# Altium schematic sheet Top.schdoc
size 297 x 209 mm; Symbol: Drawing-Symbol_A4; Company: 嘉立创EDA; Version: V1.0; Page Size: A4; @Project Name: Buck电路; @Update Date: 2026-08-22; @Create Date: 2026-08-22; Device: Drawing-Symbol_A4; @Board Name: Board1; @Page Name: P1; @Create Time: 15:29:09; @Page Count: 1; @Page No: 1; @Schematic Name: Schematic1; @Update Time: 15:29:09; @Assembly Variant: Basic; Border: 1; Title Block Position: 3; Size: A4; Width: 1170; Height: 825; Region Start: 1; X Region Count: 6; Y Region Count: 4; Blade Width: 10
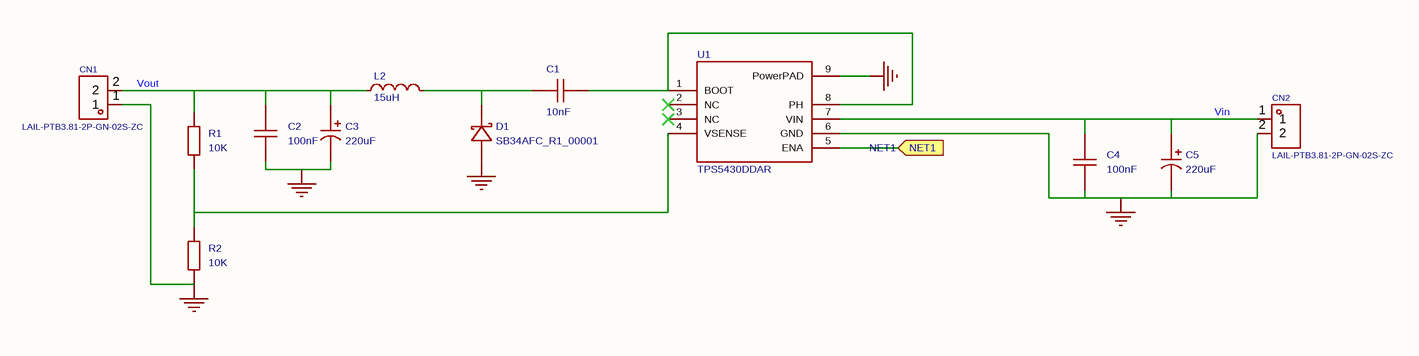
[diagram p0: Top.schdoc]

## Parts
C1  10nF  [C0603]
C2  100nF  [C0603]
C3  220uF  [CAP-SMD_BD6.3-L6.6-W6.6-LS7.3-FD]
C4  100nF  [C0603]
C5  220uF  [CAP-SMD_BD6.3-L6.6-W6.6-LS7.3-FD]
CN1  LAIL-PTB3.81-2P-GN-02S-ZC  [CONN-TH_LAIL-PTB3.81-2P-GN-02S-ZC]
CN2  LAIL-PTB3.81-2P-GN-02S-ZC  [CONN-TH_LAIL-PTB3.81-2P-GN-02S-ZC]
D1  SB34AFC_R1_00001  [SMAF_L3.5-W2.6-LS4.7-RD]
L2  15uH  [IND-SMD_L7.0-W6.6_FXL0630]
R1  10K  [R0603]
R2  10K  [R0603]
U1  TPS5430DDAR  [ESOP-8_L4.9-W3.9-P1.27-LS6.0-TL-EP]

## Ports
NET1 (in)

## Nets
GND: C2.1 C3.2 C4.1 C5.2 CN1.1 CN2.2 D1.2(A) R2.1 U1.6(GND) U1.9(PowerPAD)
NET1: U1.5(ENA) ; port NET1
Vin: C4.2 C5.1 CN2.1 U1.7(VIN)
Vout: C2.2 C3.1 CN1.2 L2.1 R1.2
NetC1_1: C1.1 U1.1(BOOT) U1.8(PH)
NetC1_2: C1.2 D1.1(K) L2.2
NetR1_1: R1.1 R2.2 U1.4(VSENSE)

Not connected (* = marked no-connect by the designer): U1 2(NC)* 3(NC)*

## Notes on the sheet
- 创建日期
- 2026-08-22
- 原理图
- 板子
- Schematic1
- Board1
- 更新日期
- 图页
- P1
- 绘制
- 审阅
- Buck电路
- 版本
- V1.0
- 尺寸
- A4
- 页    1    共    1
- 嘉立创EDA

## Library data of the parts
C1 = CT41G-0603-2X1-50V-0.01uF-K(N)_C136131: 容值:10nF;精度:±10%;额定电压:50V;温度系数:-;; Manufacturer: TORCH(火炬); AddInBom: yes; ModelId: ac125912035d415993ca9572d50418b10819f05c4eef4c71ace90d822a990e87; ModelName: C0603_L1.6-W0.8-H0.8; ModelTransform: 62.992,31.496,0,0,0,0,0,0,0; Tolerance: ±10%; Voltage Rating: 50V; Symbol: CT41G-0603-2X1-50V-0.01UF-K(N); Device: CT41G-0603-2X1-50V-0.01uF-K(N)_C136131; LCSC Part Name: 10nF ±10% 50V; SupplierPart: C136131; ManufacturerPart: CT41G-0603-2X1-50V-0.01uF-K(N); Supplier Footprint: 0603; JLCPCB Part Class: Extended Part; Datasheet: https://item.szlcsc.com/datasheet/CT41G-0603-2X1-50V-0.01uF-K(N)/147444.html; Supplier: LCSC; ConvertToPcb: yes; FootprintName: C0603; Value: 10nF; Temperature Coefficient: -
C2 C4 = CAP_0603: Symbol: Capacitance; ConvertToPcb: yes; ModelId: ac125912035d415993ca9572d50418b10819f05c4eef4c71ace90d822a990e87; ModelName: C0603_L1.6-W0.8-H0.8; ModelTransform: 62.992,31.496,0,0,0,0,0,0,0; Device: CAP_0603; AddInBom: yes; Supplier Footprint: 0603; FootprintName: C0603; Value: 100nF
C3 C5 = MA25V220M6X8: 容值:220uF;精度:±20%;额定电压:25V;纹波电流:2.9A@100kHz;等效串联电阻(ESR):28mΩ@100kHz;类型:聚合物;; Manufacturer: JIERR(捷而瑞); AddInBom: yes; ModelId: 697a8c63e3274188b68c96045bc3ea1c0819f05c4eef4c71ace90d822a990e87; ModelTransform: 287.401,259.842,0,180,0,0,0.001,0.001,0; Tolerance: ±20%; Voltage Rating: 25V; Type: 聚合物; Lifetime: 2000hrs@105℃; Symbol: MA25V220M6X8; Device: MA25V220M6X8; LCSC Part Name: 220uF ±20% 25V; SupplierPart: C46550464; ManufacturerPart: MA25V220M6X8; Supplier Footprint: SMD,D6.3xL7.7mm; JLCPCB Part Class: Extended Part; Datasheet: https://item.szlcsc.com/datasheet/MA25V220M6X8/48680158.html; Supplier: LCSC; ConvertToPcb: yes; FootprintName: CAP-SMD_BD6.3-L6.6-W6.6-LS7.3-FD; ModelName: CAP-SMD_BD6.3-L6.6-W6.6-LS7.3-FD; Value: 220uF; Ripple Current: 2.9A@100kHz; Equivalent Series Resistance(ESR): 28mΩ@100kHz; Diameter: 6.3mm; Height - Seated (Max): 7.7mm; Operating Temperature: -55℃~+105℃
CN1 CN2 = LAIL-PTB3.81-2P-GN-02S-ZC: 连接器类型:板端/插座-开口;结构:1x2P;间距:3.81mm;颜色:绿色;安装方式:直插;排数:1;每排PIN数:2;额定电流:8A;额定电压:300V;工作温度:-40℃~+105℃;; Manufacturer: LAILAN(莱联); AddInBom: yes; Number of Positions or Pins: 1x2P; Pitch: 3.81mm; Number of PINs Per Row: 2; Current Rating: 8A; Voltage Rating (Max): 300V; Symbol: LAIL-PTB3.81-2P-GN-02S-ZC; Device: LAIL-PTB3.81-2P-GN-02S-ZC; LCSC Part Name: 1x2P 3.81mm 排数:1 每排P数:2; SupplierPart: C55144765; ManufacturerPart: LAIL-PTB3.81-2P-GN-02S-ZC; Supplier Footprint: 插件,P=3.81mm; JLCPCB Part Class: Extended Part; Datasheet: https://item.szlcsc.com/datasheet/LAIL-PTB3.81-2P-GN-02S-ZC/58884909.html; Supplier: LCSC; ConvertToPcb: yes; FootprintName: CONN-TH_LAIL-PTB3.81-2P-GN-02S-ZC; Connector Type: 板端/插座-开口; Color: 绿色; Mounting Type: 直插; Number of Pins: 2P; Number of Rows: 1; Operating Temperature: -40℃~+105℃
D1 = SB34AFC_R1_00001: 二极管配置:1个独立式;正向压降(Vf):500mV@3A;直流反向耐压(Vr):40V;整流电流:3A;; Manufacturer: PANJIT(强茂); AddInBom: yes; ModelId: 4caf566195a049cf809ac17c4d6419320819f05c4eef4c71ace90d822a990e87; ModelName: SMAF_L3.5-W2.6-LS4.7-RD-1; ModelTransform: 183.0705,102.362,0,0,0,0,0,0,0; Diode Configuration: 1个独立式; Voltage - DC Reverse(Vr): 40V; Current - Rectified: 3A; Reverse Leakage Current (Ir): 100uA@40V; Operating Junction Temperature Range: -55℃~+150℃; Non-Repetitive Peak Forward Surge Current: 80A; Symbol: SB34AFC_R1_00001; Device: SB34AFC_R1_00001; LCSC Part Name: 电压:40V 电流:3A; SupplierPart: C7308969; ManufacturerPart: SB34AFC_R1_00001; Supplier Footprint: SMAF-C; JLCPCB Part Class: Extended Part; Datasheet: https://item.szlcsc.com/datasheet/SB34AFC_R1_00001/8279456.html; Supplier: LCSC; ConvertToPcb: yes; FootprintName: SMAF_L3.5-W2.6-LS4.7-RD; Voltage - Forward(Vf@If): 500mV@3A
L2 = FXL0630-150-M: 电感值:15uH;精度:±20%;额定电流:3A;饱和电流(Isat):4A;类型:一体成型电感;; Manufacturer: cjiang(长江微电); AddInBom: yes; ModelId: 6712504104d74f0ca01cd7d0df9965b70819f05c4eef4c71ace90d822a990e87; ModelName: IND-SMD_L7.0-W6.6-H2.8_FXL0630; ModelTransform: 275.59,259.842,0,0,0,0,0,0,0; Tolerance: ±20%; Current Rating: 3A; Current - Saturation(Isat): 4A; DC Resistance(DCR): 115mΩ; Type: 一体成型电感; Symbol: FXL0630-150-M; Device: FXL0630-150-M; LCSC Part Name: 15uH ±20%; SupplierPart: C177243; ManufacturerPart: FXL0630-150-M; Supplier Footprint: SMD,7x6.6mm; JLCPCB Part Class: Extended Part; Datasheet: https://item.szlcsc.com/datasheet/FXL0630-150-M/188635.html; Supplier: LCSC; ConvertToPcb: yes; FootprintName: IND-SMD_L7.0-W6.6_FXL0630; Value: 15uH; Ratings: -
R1 R2 = Res_0603: Symbol: 电阻; ConvertToPcb: yes; ModelId: fc143cca1e79419f9cd78b61e9279f080819f05c4eef4c71ace90d822a990e87; ModelTransform: 31.8897,63.7794,0,90,0,0,0,0,0; Device: Res_0603; AddInBom: yes; Supplier Footprint: 0603; FootprintName: R0603; ModelName: R0603; Value: 10K
U1 = TPS5430DDAR: 功能类型:降压型;工作电压:5.5V~36V;输出电压:1.221V~32.04V;输出电流:3A;输出类型:可调;; Manufacturer: TI(德州仪器); AddInBom: yes; ModelId: 821ddb58f3244ffb9a5d6f8174c5b14e0819f05c4eef4c71ace90d822a990e87; ModelTransform: 236.22,192.913,0,0,0,0,0,0,0; Function: 降压型; Output Current: 3A; Frequency - Switching: 500kHz; Synchronous Rectifier: 否; Number of Outputs: 1; Topology: 降压式; Quiescent Current: 4.4mA; Switch tube (built-in/external): 内置; Output Type: 可调; Symbol: TPS5430DDAR; Device: TPS5430DDAR; LCSC Part Name: 降压型 3A 5.5V~36V; SupplierPart: C9864; ManufacturerPart: TPS5430DDAR; Supplier Footprint: SOIC-8-EP; JLCPCB Part Class: Basic Part; Datasheet: https://www.ti.com/cn/lit/ds/symlink/tps5430.pdf; Supplier: LCSC; ConvertToPcb: yes; FootprintName: ESOP-8_L4.9-W3.9-P1.27-LS6.0-TL-EP; ModelName: ESOP-8_L4.9-W3.9-P1.27-LS6.0-TL-EP; Voltage - Supply: 5.5V~36V; Output Voltage: 1.221V~32.04V; Operating Temperature: -40℃~+125℃@(TJ); Features: 逐波限流；过流保护；打嗝限流